# EAGLE schematic V1 (EAGLE 9.6.2)
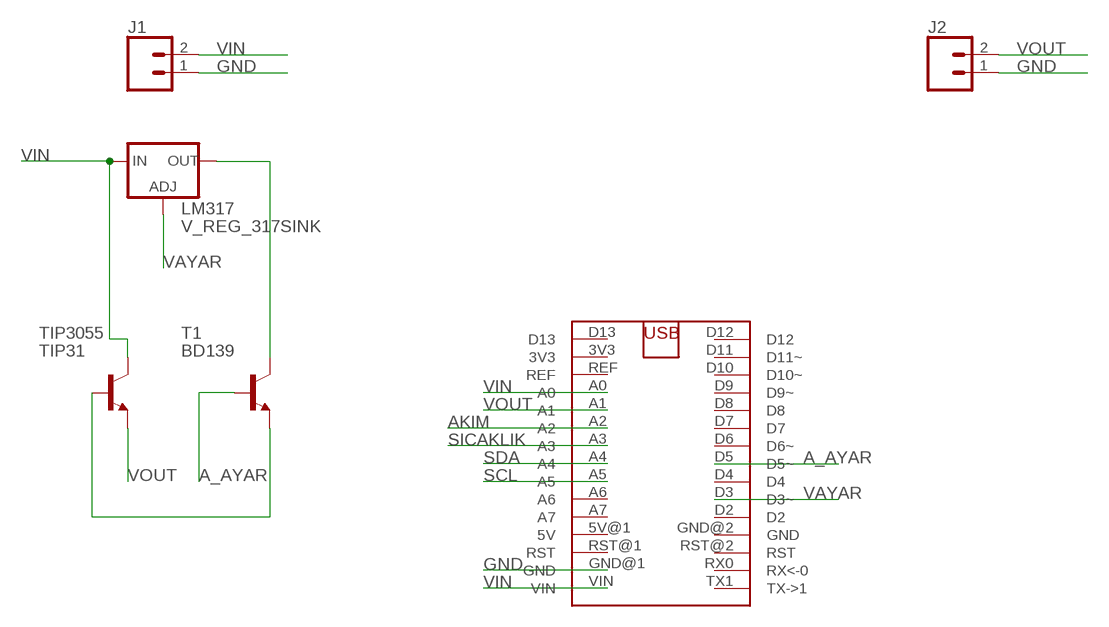
[diagram p0: schematic, sheet 1]

## Parts
J1  CONN_021X02_NO_SILK  [1X02_NO_SILK]
J2  CONN_021X02_NO_SILK  [1X02_NO_SILK]
LM317  V_REG_317SINK  [TO220-ADJ]
T1  BD139  [TO126]
TIP3055  TIP31  [TO220]
U$1  ARDUINO_NANO  [ARDUINO_NANO]

## Nets
A_AYAR: T1.3(B) U$1.D5(D5~)
AKIM: U$1.A2
GND: J1.1 J2.1 U$1.GND@1(GND)
N$1: T1.1(E) TIP3055.1(B)
SCL: U$1.A5
SDA: U$1.A4
SICAKLIK: U$1.A3
VAYAR: LM317.ADJ U$1.D3(D3~)
VIN: J1.2 LM317.IN TIP3055.2(C) U$1.A0 U$1.VIN
VOUT: J2.2 LM317.OUT T1.2(C) TIP3055.3(E) U$1.A1
Unconnected: U$1.3V3 U$1.5V@1(5V) U$1.A6 U$1.A7 U$1.D2 U$1.D4 U$1.D6(D6~) U$1.D7 U$1.D8 U$1.D9(D9~) U$1.D10(D10~) U$1.D11(D11~) U$1.D12 U$1.D13 U$1.GND@2(GND) U$1.REF U$1.RST@1(RST) U$1.RST@2(RST) U$1.RX0(RX<-0) U$1.TX1(TX->1)

## Library data of the parts
J1 J2 = SparkFun-Connectors:CONN_02: Multi connection point. Often used as Generic Header-pin footprint for 0.1 inch spaced/style header connections On any of the 0.1 inch spaced packages, you can populate with these: Break Away Headers - Straight <https://www.sparkfun.com/products/116> (PRT-00116) Break Away Male Headers - Right Angle <https://www.sparkfun.com/products/553> (PRT-00553) Female Headers <https://www.sparkfun.com/products/115> (PRT-00115) Break Away Headers - Machine Pin <https://www.sparkfun.com/products/117> (PRT-00117) Break Away Female Headers - Swiss Machine Pin <https://www.sparkfun.com/products/743> (PRT-00743) For SCREWTERMINALS and SPRING TERMINALS visit here: Screw Terimnals on SparkFun.com <https://www.sparkfun.com/search/results?term=Screw+Terminals> (5mm/3.5mm/2.54mm spacing) This device is also useful as a general connection point to wire up your design to another part of your project. Our various solder wires solder well into these plated through hole pads. Hook-Up Wire - Assortment (Stranded, 22 AWG) <https://www.sparkfun.com/products/11375> (PRT-11375) Hook-Up Wire - Assortment (Solid Core, 22 AWG) <https://www.sparkfun.com/products/11367> (PRT-11367) View the entire wire category on our website here <https://www.sparkfun.com/categories/141> Special notes: Molex polarized connector foot print use with: PRT-08233 with associated crimp pins and housings. 2.54_SCREWTERM for use with PRT-10571. 3.5mm Screw Terminal footprints for PRT-08084 5mm Screw Terminal footprints for use with PRT-08432
LM317 = SparkFun-IC-Power:V_REG_317: Voltage Regulator Standard LM317 adjustable voltage regulator. AOI (Adjust Output Input). Google 'LM317 Calculator' for easy to use app to get the two resistor values needed. 240/720 for 5V output. 240/390 for 3.3V output. Spark Fun Electronics SKU : COM-00527
T1 = transistor:BD139: NPN TRANSISTOR
TIP3055 = transistor:TIP31: NPN Transistor Medium Power Linear Switching Applications Source: http://onsemi.com
U$1 = El_yapimi:ARDUINO_NANO